# EAGLE design Triac-Board (EAGLE 7.2.0)
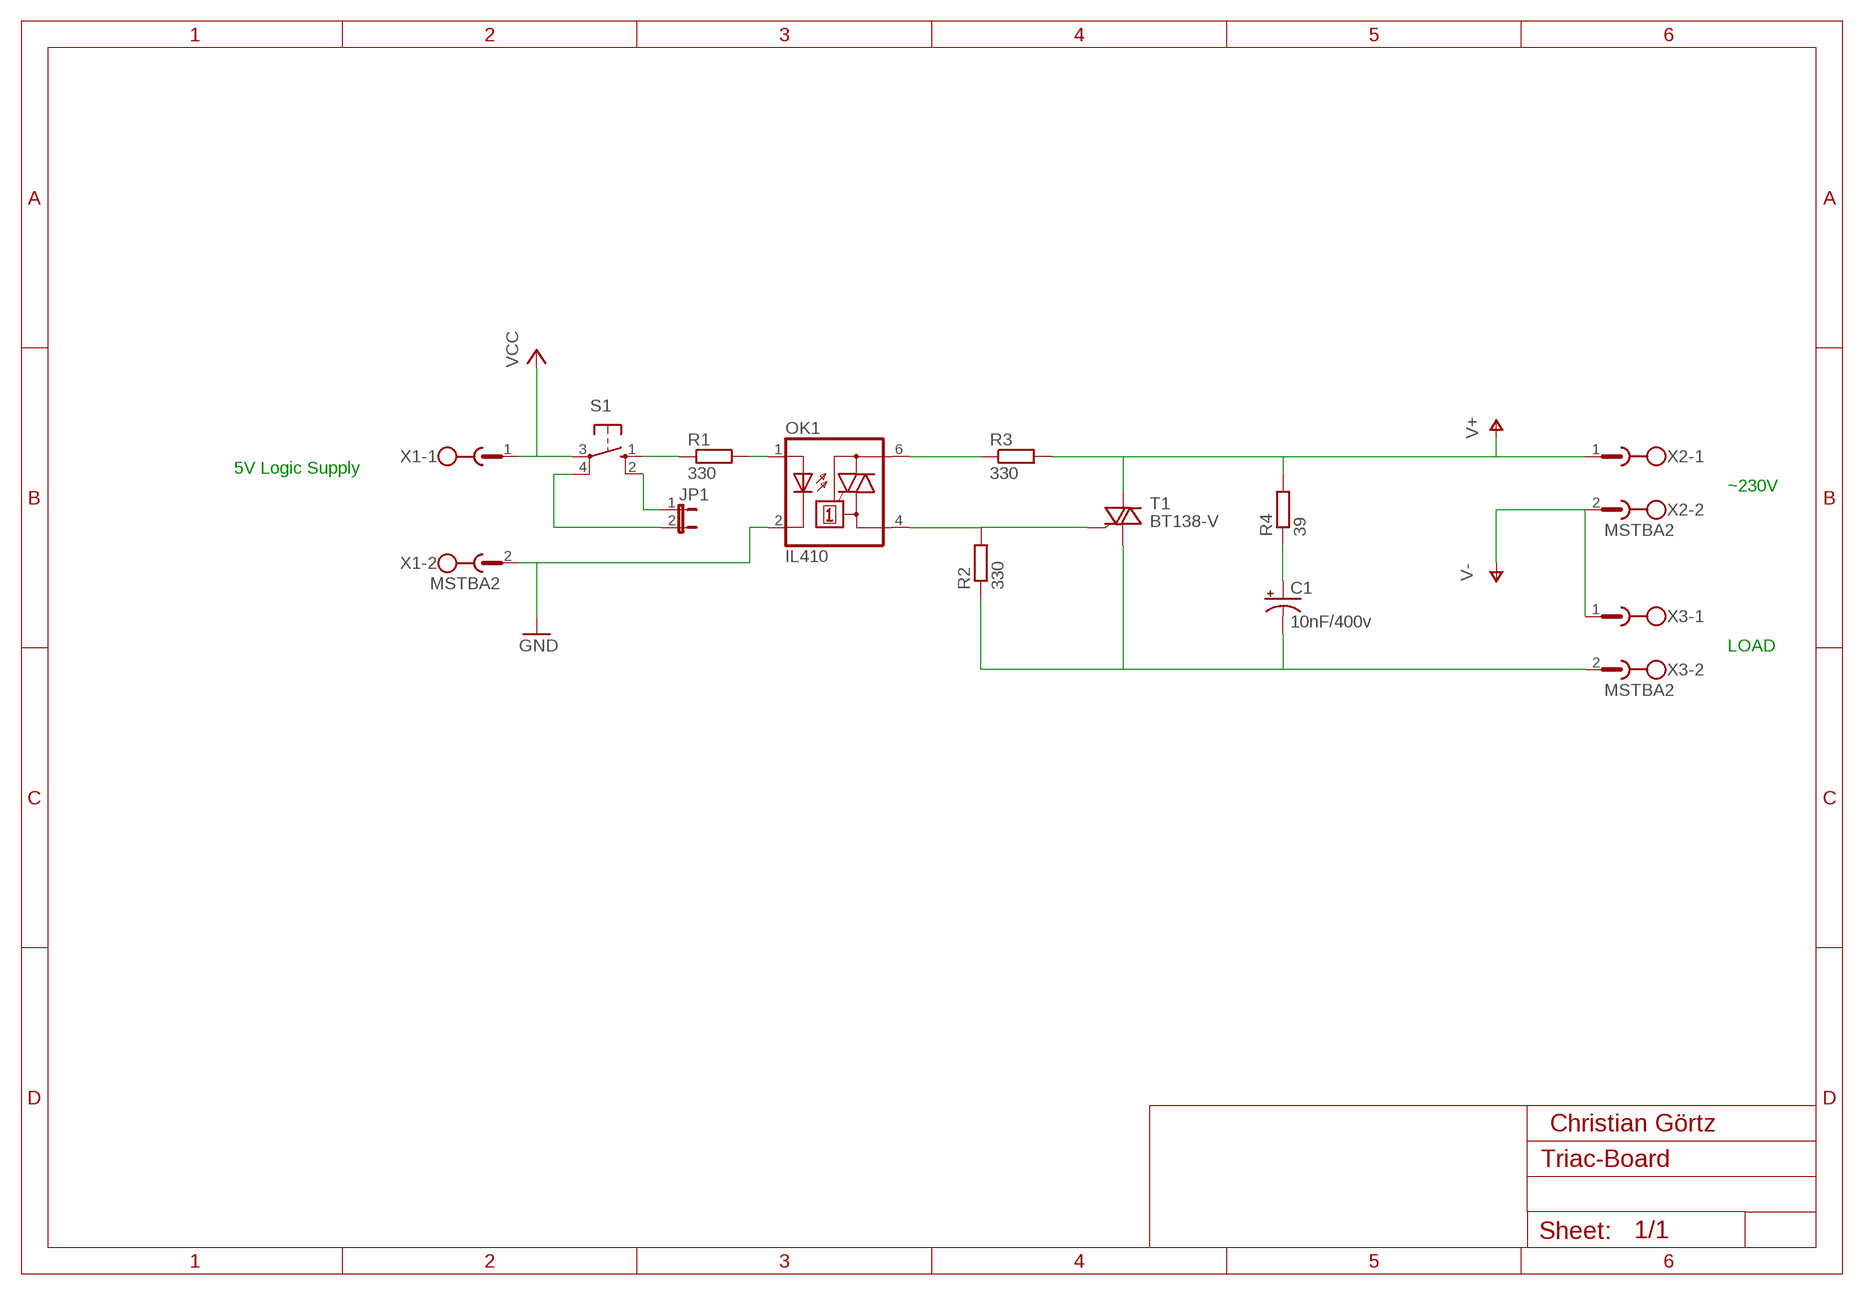
[diagram p0: schematic, sheet 1]

## Parts
C1  10nF/400v  CPOL-USE5-5  [E5-5]
JP1  JP1E  [JP1]
OK1  IL410  [DIL06]
R1  330  R-EU_0207/12  [0207/12]
R2  330  R-EU_0207/12  [0207/12]
R3  330  R-EU_0207/12  [0207/12]
R4  39  R-EU_0207/12  [0207/12]
S1  10-XX  [B3F-10XX]
T1  BT138-V  [TO220BV]
X1  MSTBA2  [MSTBA2]
X2  MSTBA2  [MSTBA2]
X3  MSTBA2  [MSTBA2]

## Nets
GND: OK1.2(C) X1.2
N$1: OK1.1(A) R1.2
N$2: R1.1 S1.1(S)
N$4: OK1.6(A2) R3.1
N$5: JP1.1 S1.2(S1)
N$6: JP1.2 S1.4(P1)
N$7: OK1.4(A1) R2.2 T1.G
N$8: C1.+ R4.1
N$9: C1.- R2.1 T1.T1(A1) X3.2
V+: R3.2 R4.2 T1.T2(A2) X2.1
V-: X2.2 X3.1
VCC: S1.3(P) X1.1

## Notes on the sheet
- 5V Logic Supply
- ~230V
- LOAD
- Christian Görtz

## Library data of the parts
C1 = resistor:CPOL-US: POLARIZED CAPACITOR, American symbol
JP1 = jumper:JP1E: JUMPER
OK1 = optocoupler:IL410: SIEMENS OPTO COUPLER; MF: VISHAY/TELEFUNKEN; MPN: IL410; OC_FARNELL: 1045434; OC_NEWARK: 58K1715
R1-R4 = resistor:R-EU_: RESISTOR, European symbol
S1 = switch-omron:10-XX: OMRON SWITCH; MPN: B3F-1000; OC_FARNELL: 176432; OC_NEWARK: 36M3542
T1 = triac:BT138: TRIAC Source: http://www.semiconductors.philips.com BT138_SERIES_2.pdf
X1-X3 = con-phoenix-508:MSTBA2: PHOENIX; MF: FARNELL; MPN: 1757242; OC_FARNELL: 3705171; OC_NEWARK: 71C4161

## Board
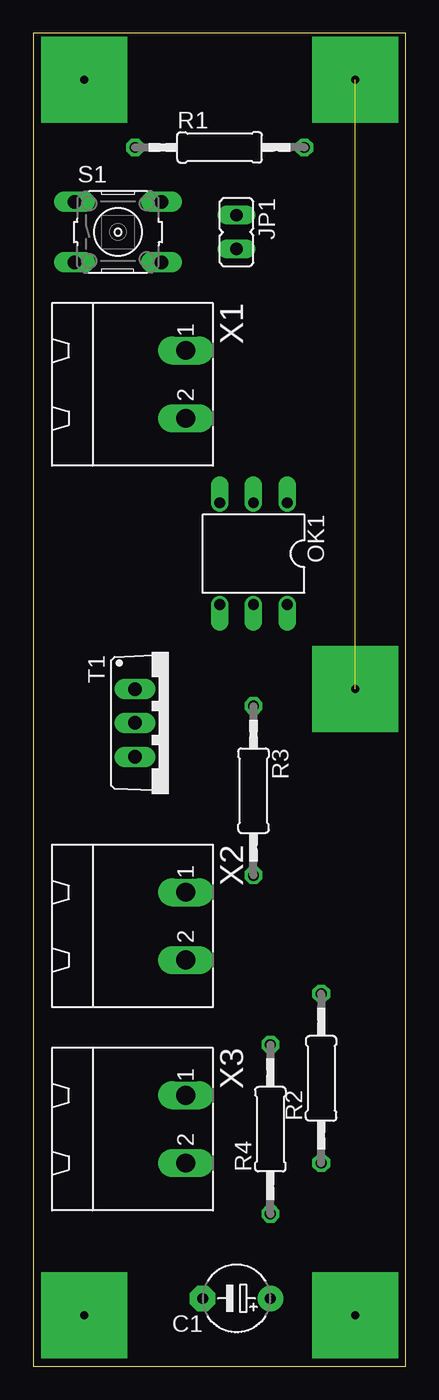
[diagram p1: board, top side]
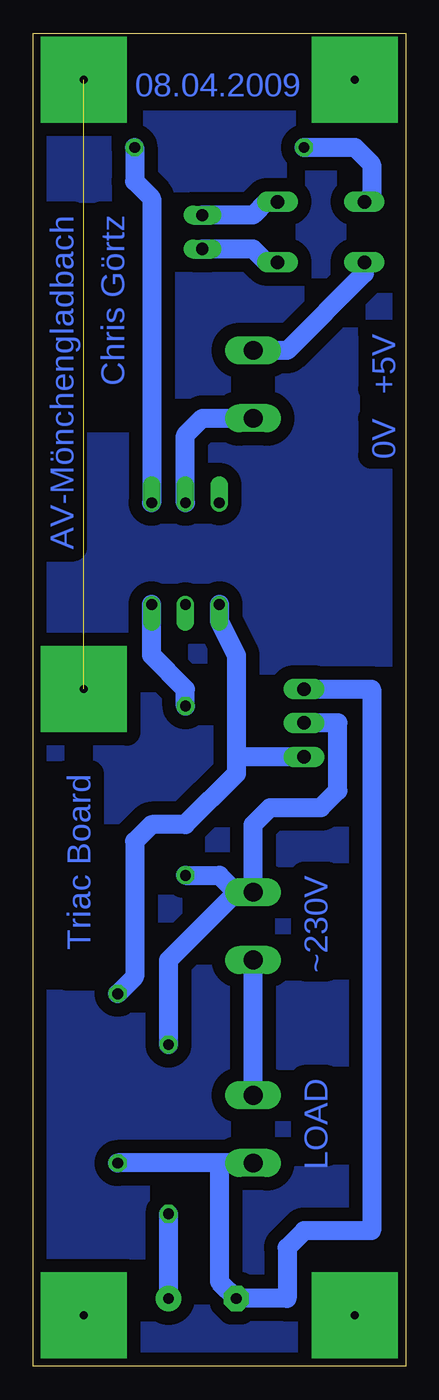
[diagram p2: board, bottom side, seen from below]

Size 27.92 x 100 mm. Coordinates in mm from the lower left corner, seen from the top.
Outline: 0,0 27.92,0 27.92,100 0,100 0,0
Copper layers (1*16): Top 0.035mm / dielectric 1.5mm / Bottom 0.035mm
Design rules "default": minimum track width 10mil, minimum drill 24mil, track to track 8mil, track to pad 8mil, pad to pad 8mil, via to via 8mil, smd to smd 8mil, copper to edge 40mil, drill to drill 8mil, minimum pad ring 10mil, minimum via ring 8mil, stop-mask expansion 4mil, vias tented up to drill 0mil, thermal gap 10mil

### Footprints (pad centres in the part's own frame; a part is rotated, then mirrored left to right if it is on the bottom)
E5-5 = drill 0.813 pad 1.905: + -2.54,0 | drill 0.813 pad 1.905 octagon: - 2.54,0
JP1 = drill 0.914 long: 1 0,-1.27; 2 0,1.27
DIL06 = drill 0.813 offset: 1 -2.54,-3.81; 2 0,-3.81; 3 2.54,-3.81; 4 2.54,3.81; 5 0,3.81; 6 -2.54,3.81
0207/12 = drill 0.813 octagon: 1 -6.35,0; 2 6.35,0
B3F-10XX = drill 1.016 long: 1 -3.251,2.261; 2 3.251,2.261; 3 -3.251,-2.261; 4 3.251,-2.261
TO220BV = drill 1.016 long: G 2.54,-2.54; T1 -2.54,-2.54; T2 0,-2.54
MSTBA2 = drill 1.397 long: 1 -2.54,5.08; 2 2.54,5.08

### Placement (x,y rotation side)
C1  15.24,5.08 180 top
JP1  15.24,85.09 180 top
OK1  16.51,60.96 180 top
R1  13.97,91.44 0 top
R2  21.59,21.59 90 top
R3  16.51,43.18 270 top
R4  17.78,17.78 90 top
S1  6.35,85.09 0 top
T1  10.16,48.26 270 top
X1  6.35,73.66 270 top
X2  6.35,33.02 270 top
X3  6.35,17.78 270 top

### Tracks (layer width: path | path; a pad name or v marks a point on that pad's centre or on a via)
GND
  Bottom 1.422: OK1.2 16.51,69.85 15.24,71.12 X1.2
N$1
  Bottom 1.422: R1.2 20.32,88.9 19.05,87.63 OK1.1
N$2
  Bottom 1.422: R1.1 3.81,91.44 2.54,90.17 2.54,87.91 S1.1
N$3  (via drill 0.6 pad 6.45)
  other vias: 3.81,96.52
N$4
  Bottom 1.422: R3.1 16.51,50.8 19.05,53.34 OK1.6
N$5
  Bottom 1.422: S1.2 10.44,87.35 11.43,86.36 JP1.1
N$6
  Bottom 1.422: S1.4 10.44,82.83 11.43,83.82 JP1.2
N$7
  Bottom 1.422: T1.G 12.7,45.72 | OK1.4 13.97,55.88 12.7,53.34 12.7,45.72 | 12.7,45.72 12.7,44.45 16.51,40.64 19.05,40.64 20.32,39.37 20.32,29.21 R2.2
N$8
  Bottom 1.422: C1.+ R4.1
N$9
  Bottom 1.422: T1.T1 2.54,50.8 2.54,10.16 7.62,10.16 8.89,8.89 8.89,5.08 C1.- 13.97,6.35 13.97,15.24 | 13.97,15.24 R2.1 | X3.2 13.97,15.24
N$10  (via drill 0.6 pad 6.45)  (1 unrouted)
  other vias: 24.13,96.52 24.13,50.8
N$11  (via drill 0.6 pad 6.45)
  other vias: 3.81,3.81
N$12  (via drill 0.6 pad 6.45)
  other vias: 24.13,3.81
N$13
  pour Bottom (isolate 1.016): 1.27,99.06 26.67,99.06 26.67,1.27 1.27,1.27
V+
  Bottom 1.422: T1.T2 5.08,48.26 5.08,43.18 6.35,41.91 10.16,41.91 11.43,40.64 X2.1 12.7,35.56 | R4.2 17.78,30.48 12.7,35.56 | R3.2 13.97,36.83 12.7,35.56
V-
  Bottom 1.422: X3.1 X2.2
VCC
  Bottom 1.422: S1.3 3.1,81.99 8.89,76.2 X1.1

### Text on the board
Bottom: 08.04.2009 | Chris Görtz | AV-Mönchengladbach | +5V | 0V | Triac Board | ~230V | LOAD